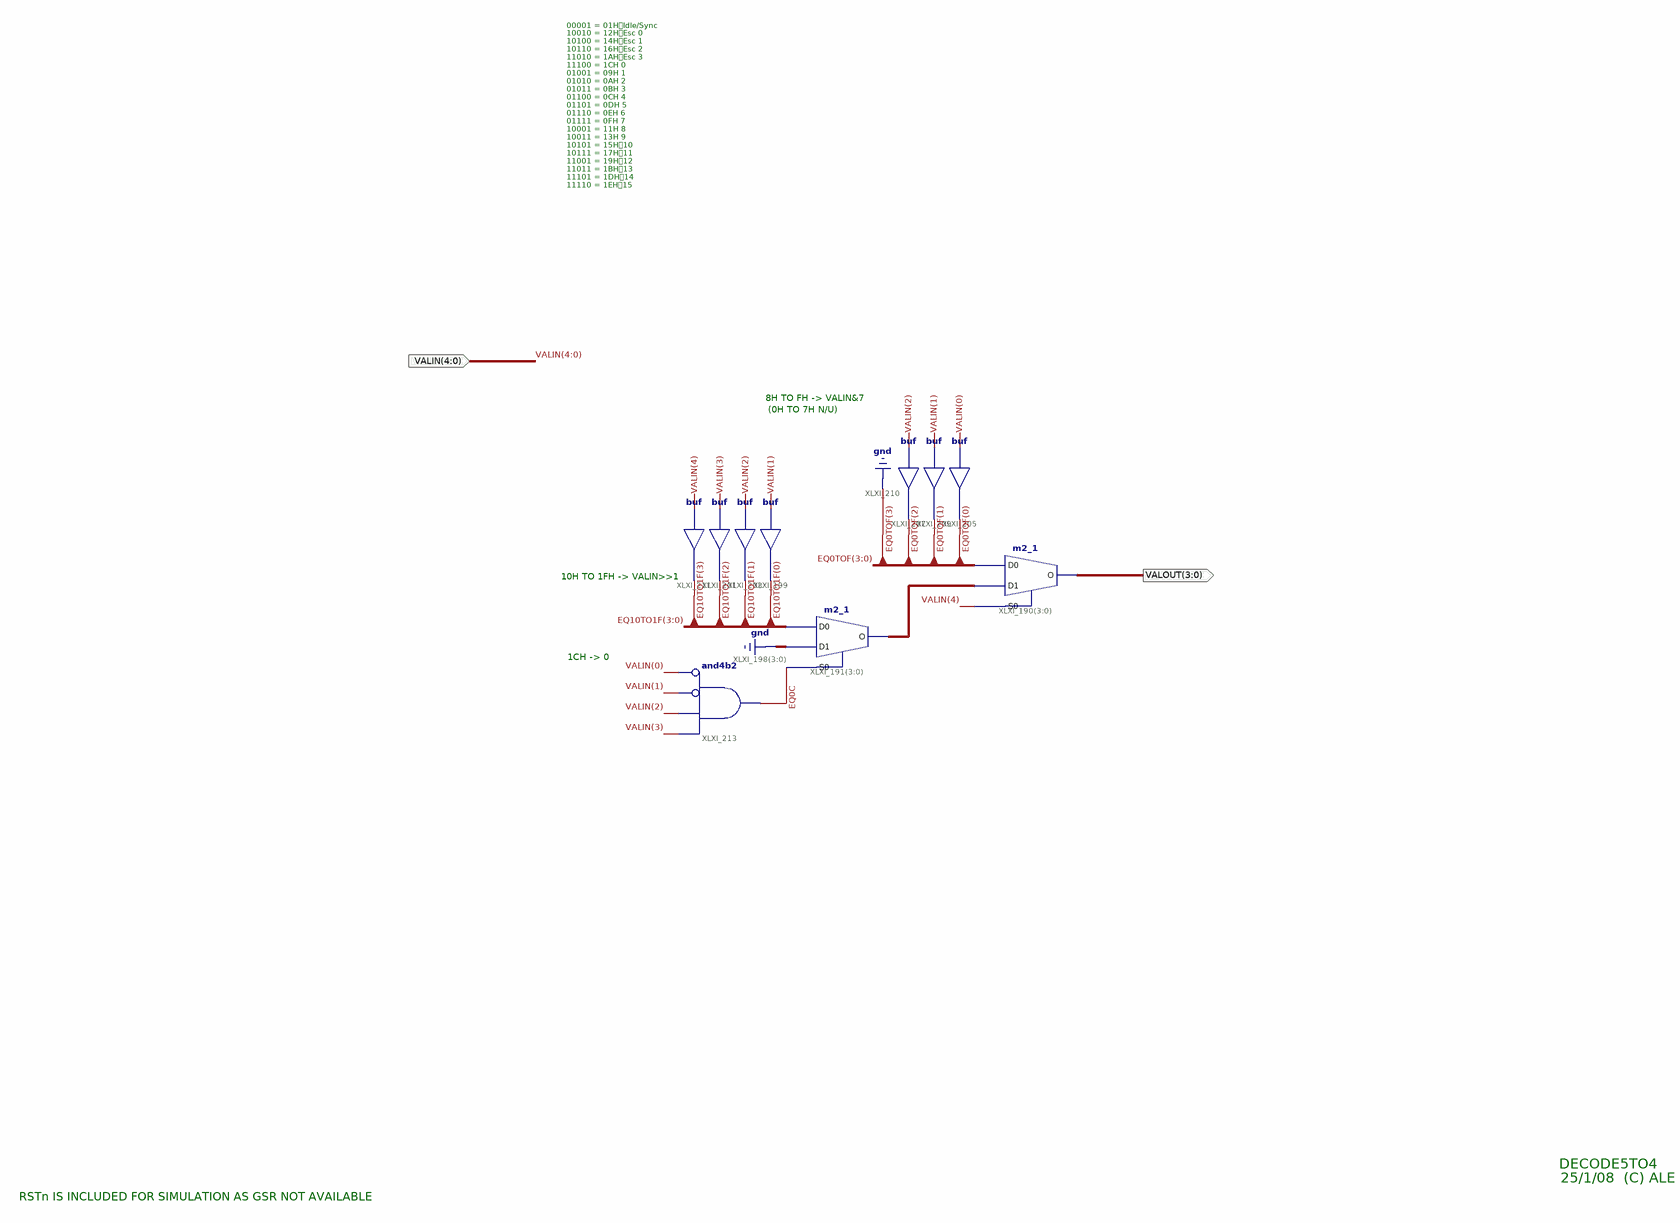
[diagram p0: schematic sheet 1]
// Xilinx ISE schematic Decode5To4.sch (spartan6) as structural Verilog: 10 symbols, 2 ports
module Decode5To4 (
  input  [4:0] VALIN,
  output [3:0] VALOUT
);

  wire EQ0C;
  wire [2:0] EQ0TOF;
  wire [3:0] EQ10TO1F, XLXN_152;

  m2_1 XLXI_190[3:0] (.D0({1'b0, EQ0TOF}), .D1(XLXN_152), .S0(VALIN[4]), .O(VALOUT));
  m2_1 XLXI_191[3:0] (.D0(EQ10TO1F), .D1(4'b0000), .S0(EQ0C), .O(XLXN_152));
  buf XLXI_199 (EQ10TO1F[0], VALIN[1]);
  buf XLXI_201 (EQ10TO1F[2], VALIN[3]);
  buf XLXI_203 (EQ10TO1F[1], VALIN[2]);
  buf XLXI_205 (EQ0TOF[0], VALIN[0]);
  buf XLXI_207 (EQ0TOF[2], VALIN[2]);
  buf XLXI_209 (EQ0TOF[1], VALIN[1]);
  buf XLXI_211 (EQ10TO1F[3], VALIN[4]);
  and XLXI_213 (EQ0C, ~VALIN[0], ~VALIN[1], VALIN[2], VALIN[3]);  // and4b2

  // Notes on the sheet:
  //   00001 = 01H	Idle/Sync
  //   10010 = 12H	Esc 0
  //   10100 = 14H	Esc 1
  //   10110 = 16H	Esc 2
  //   11010 = 1AH	Esc 3
  //   11100 = 1CH 0
  //   01001 = 09H 1
  //   01010 = 0AH 2
  //   01011 = 0BH 3
  //   01100 = 0CH 4
  //   01101 = 0DH 5
  //   01110 = 0EH 6
  //   01111 = 0FH 7
  //   10001 = 11H 8
  //   10011 = 13H 9
  //   10101 = 15H	10
  //   10111 = 17H	11
  //   11001 = 19H	12
  //   11011 = 1BH	13
  //   11101 = 1DH	14
  //   11110 = 1EH	15
  //   8H TO FH -> VALIN&7
  //   (0H TO 7H N/U)
  //   10H TO 1FH -> VALIN>>1
  //   1CH -> 0
  //   DECODE5TO4
  //   25/1/08  (C) ALE
  //   RSTn IS INCLUDED FOR SIMULATION AS GSR NOT AVAILABLE
endmodule
